# Altium schematic sheet Controller.SchDoc
size A3
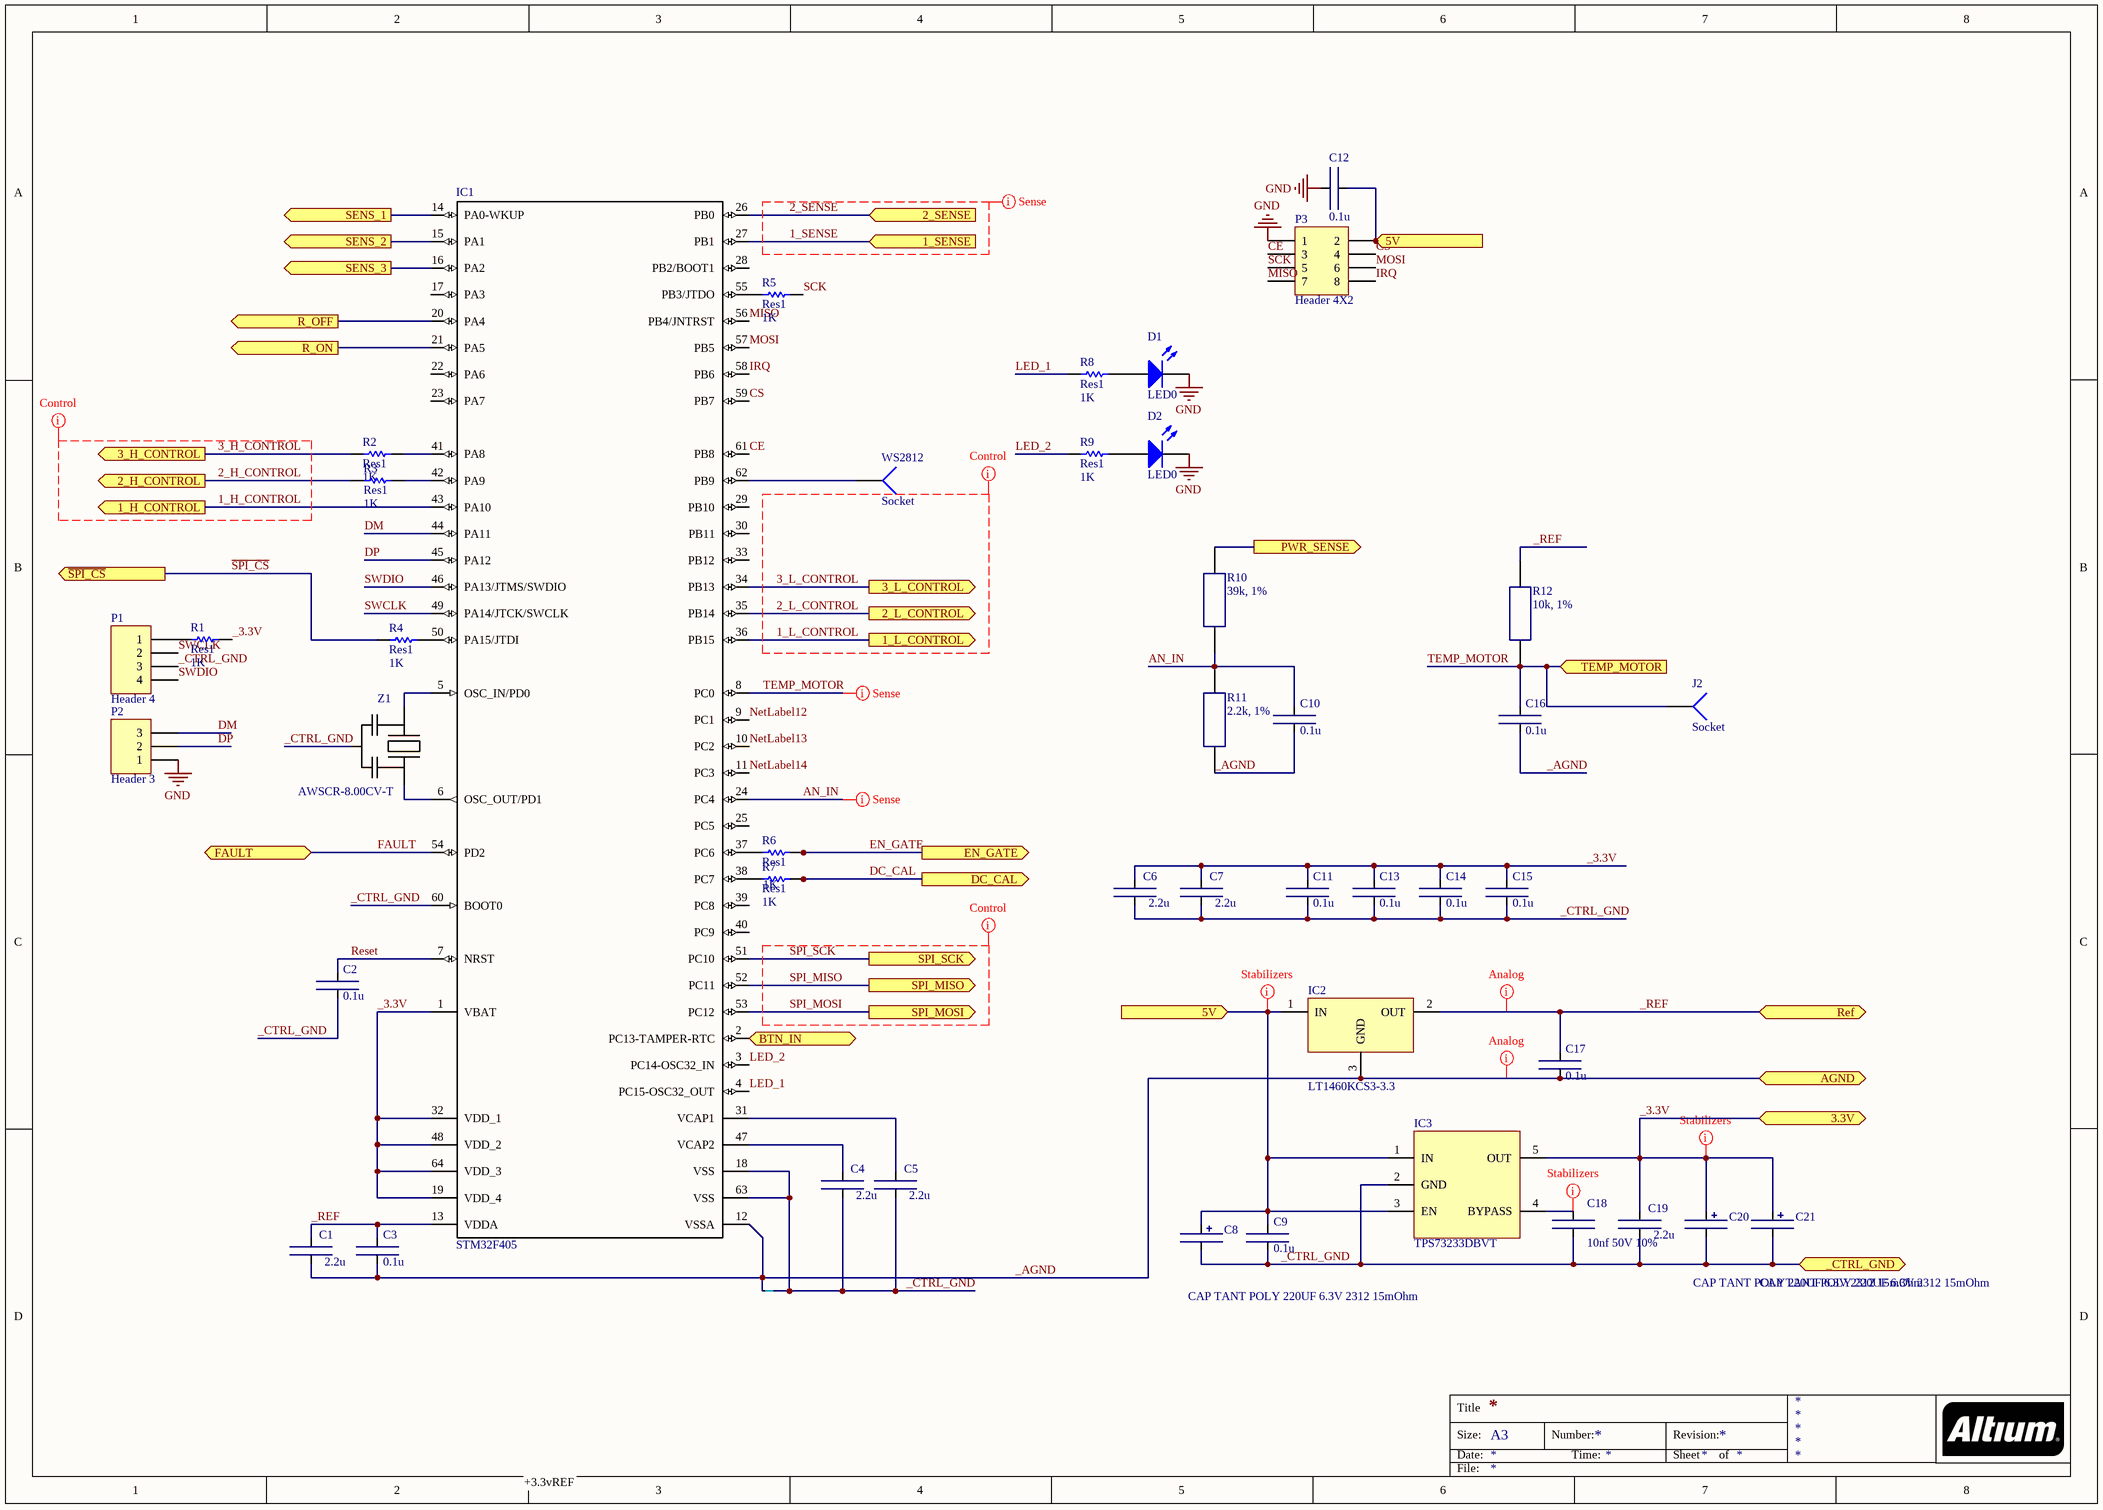
[diagram p0: Controller.SchDoc]

## Parts
C1  2.2u  [ERA-0603]
C2  0.1u  [CAPC1608X08N(0603)]
C3  0.1u  [ERA-0603]
C4  2.2u  [CAPC1608X08N(0603)]
C5  2.2u  [CAPC1608X08N(0603)]
C6  2.2u  [CAPC1608X08N(0603)]
C7  2.2u  [CAPC1608X08N(0603)]
C8  CAP TANT POLY 220UF 6.3V 2312 15mOhm  [CAP_POLY_330]
C9  0.1u  [ERA-0603]
C10  0.1u  [CAPC1608X08N(0603)]
C11  0.1u  [CAPC1608X08N(0603)]
C12  0.1u  [0805x]
C13  0.1u  [CAPC1608X08N(0603)]
C14  0.1u  [CAPC1608X08N(0603)]
C15  0.1u  [CAPC1608X08N(0603)]
C16  0.1u  [CAPC1608X08N(0603)]
C17  0.1u  [0603x]
C18  10nf 50V 10%  [0402small]
C19  2.2u  [CAPC1608X08N(0603)]
C20  CAP TANT POLY 220UF 6.3V 2312 15mOhm  [C]
C21  CAP TANT POLY 220UF 6.3V 2312 15mOhm  [CAP_POLY_330]
D1  LED0  [LED_3mm_SMD]
D2  LED0  [LED_3mm_SMD]
IC1  STM32F405  [LQFP64_L]
IC2  LT1460KCS3-3.3  [SOT23-3_L]
IC3  TPS73233DBVT  [SOT23-5_L]
J2  Socket  [PIN1]
NT1  NET_TIE  [NET_TIE_10mil]  (value not drawn)  (net tie, no BOM)
P1  Header 4  [MHDR1X4]
P2  Header 3  [HDR1X3]
P3  Header 4X2  [Nrf24l01]
R1  Res1  value 1K  [0603x]
R2  Res1  value 1K  [1206x]
R3  Res1  value 1K  [0603x]
R4  Res1  value 1K  [0603x]
R5  Res1  value 1K  [1206x]
R6  Res1  value 1K  [0805x]
R7  Res1  value 1K  [0603x]
R8  Res1  value 1K  [1206x]
R9  Res1  value 1K  [1206x]
R10  39k, 1%  [1206x]
R11  2.2k, 1%  [RESC1608X05N(0603)]
R12  10k, 1%  [RESC1608X05N(0603)]
WS2812  Socket  [PIN1]
Z1  AWSCR-8.00CV-T  [CRYSTAL_CERAMIC]

## Ports
1_H_CONTROL (out), 1_L_CONTROL (out), 1_SENSE (in), 2_H_CONTROL (out), 2_L_CONTROL (out), 2_SENSE (in), 3.3V, 3_H_CONTROL (out), 3_L_CONTROL (out), 5V (in), _CTRL_GND, AGND, BTN_IN, DC_CAL (out), EN_GATE (out), FAULT, PWR_SENSE (out), R_OFF (out), R_ON (out), Ref, SENS_1 (out), SENS_2 (out), SENS_3 (out), SPI_MISO (out), SPI_MOSI (out), SPI_SCK (out), TEMP_MOTOR (in), ~{SPI_CS} (out)

## Nets
GND: C12.1 D1.2(K) D2.2(K) P2.1 P3.1
1_H_CONTROL: IC1.43(PA10) ; port 1_H_CONTROL
1_L_CONTROL: IC1.36(PB15) ; port 1_L_CONTROL
1_SENSE: IC1.27(PB1) ; port 1_SENSE
2_H_CONTROL: R3.1 ; port 2_H_CONTROL
2_L_CONTROL: IC1.35(PB14) ; port 2_L_CONTROL
2_SENSE: IC1.26(PB0) ; port 2_SENSE
3_H_CONTROL: R2.1 ; port 3_H_CONTROL
3_L_CONTROL: IC1.34(PB13) ; port 3_L_CONTROL
5V: C8.1 C9.1 C12.2 IC2.1(IN) IC3.1(IN) IC3.3(EN) P3.2 ; port 5V
_3.3V: C6.1 C7.1 C11.1 C13.1 C14.1 C15.1 C19.1 C20.1 C21.1 IC1.1(VBAT) IC1.19(VDD_4) IC1.32(VDD_1) IC1.48(VDD_2) IC1.64(VDD_3) IC3.5(OUT) R1.2 ; port 3.3V
_AGND: C1.2 C3.2 C10.2 C16.2 C17.2 IC1.12(VSSA) IC2.3(GND) NT1.1 R11.2 ; port AGND
_CTRL_GND: C2.2 C4.2 C5.2 C6.2 C7.2 C8.2 C9.2 C11.2 C13.2 C14.2 C15.2 C18.2 C19.2 C20.2 C21.2 IC1.18(VSS) IC1.60(BOOT0) IC1.63(VSS) IC3.2(GND) NT1.2 P1.3 Z1.2(GND) ; port _CTRL_GND
_REF: C1.1 C3.1 C17.1 IC1.13(VDDA) IC2.2(OUT) R12.1 ; port Ref
AN_IN: C10.1 IC1.24(PC4) R10.2 R11.1
BTN_IN: IC1.2(PC13-TAMPER-RTC) ; port BTN_IN
CE: IC1.61(PB8) P3.3
CS: IC1.59(PB7) P3.4
DC_CAL: R7.2 ; port DC_CAL
DM: IC1.44(PA11) P2.3
DP: IC1.45(PA12) P2.2
EN_GATE: R6.2 ; port EN_GATE
FAULT: IC1.54(PD2) ; port FAULT
IRQ: IC1.58(PB6) P3.8
LED_1: IC1.4(PC15-OSC32_OUT) R8.1
LED_2: IC1.3(PC14-OSC32_IN) R9.1
MISO: IC1.56(PB4/JNTRST) P3.7
MOSI: IC1.57(PB5) P3.6
NetLabel12: IC1.9(PC1)
NetLabel13: IC1.10(PC2)
NetLabel14: IC1.11(PC3)
PWR_SENSE: R10.1 ; port PWR_SENSE
R_OFF: IC1.20(PA4) ; port R_OFF
R_ON: IC1.21(PA5) ; port R_ON
Reset: C2.1 IC1.7(NRST)
~{SPI_CS}: R4.1 ; port ~{SPI_CS}
SCK: P3.5 R5.2
SENS_1: IC1.14(PA0-WKUP) ; port SENS_1
SENS_2: IC1.15(PA1) ; port SENS_2
SENS_3: IC1.16(PA2) ; port SENS_3
SPI_MISO: IC1.52(PC11) ; port SPI_MISO
SPI_MOSI: IC1.53(PC12) ; port SPI_MOSI
SPI_SCK: IC1.51(PC10) ; port SPI_SCK
SWCLK: IC1.49(PA14/JTCK/SWCLK) P1.2
SWDIO: IC1.46(PA13/JTMS/SWDIO) P1.4
TEMP_MOTOR: C16.1 IC1.8(PC0) J2.1 R12.2 ; port TEMP_MOTOR
NetC4_1: C4.1 IC1.47(VCAP2)
NetC5_1: C5.1 IC1.31(VCAP1)
NetC18_1: C18.1 IC3.4(BYPASS)
NetD1_1: D1.1(A) R8.2
NetD2_1: D2.1(A) R9.2
NetIC1_5: IC1.5(OSC_IN/PD0) Z1.1(X1)
NetIC1_6: IC1.6(OSC_OUT/PD1) Z1.3(X2)
NetIC1_37: IC1.37(PC6) R6.1
NetIC1_38: IC1.38(PC7) R7.1
NetIC1_41: IC1.41(PA8) R2.2
NetIC1_42: IC1.42(PA9) R3.2
NetIC1_50: IC1.50(PA15/JTDI) R4.2
NetIC1_55: IC1.55(PB3/JTDO) R5.1
NetIC1_62: IC1.62(PB9) WS2812.1
NetP1_1: P1.1 R1.1

Not connected (* = marked no-connect by the designer): IC1 17(PA3) 22(PA6) 23(PA7) 25(PC5) 28(PB2/BOOT1) 29(PB10) 30(PB11) 33(PB12) 39(PC8) 40(PC9)

## Layout directives
net class Sense: 1_SENSE, 2_SENSE, AN_IN, TEMP_MOTOR
net class Stabilizers: 5V, _3.3V, _AGND, _REF, NetC18_1
net class Control: 1_H_CONTROL, 1_L_CONTROL, 2_H_CONTROL, 2_L_CONTROL, 3_H_CONTROL, 3_L_CONTROL, SPI_MISO, SPI_MOSI, SPI_SCK

## Notes on the sheet
- +3.3vREF
- Title
- Size:
- Date:
- A3
- Number:
- Time:
- Revision:
- Sheet
- of
- File:

## Library data of the parts
C1 C4-C7 C19 = Ceramic Chip Capacitor: Value: CAP CER 2.2UF 25V X5R 0603; Order Number: GRM188R61E225KA12D; Distributor: Murata Electronics; Package: CAPC1608X08N(0603)
C2 C3 C9-C17 = Ceramic Chip Capacitor: Value: CAP CER 0.1UF 50V X7R 0603; Order Number: 06035C104KAT2A; Distributor: AVX Corporation
  C2 C3 C9 C10 C16 C17: Package: 0603
  C11-C15: Package: CAPC1608X08N(0603)
C8 C20 C21 = Tantalum Chip Capacitor: Order Number: T520C227M006ATE015; Value: CAP TANT POLY 220UF 6.3V 2312 15mOhm; Package: C; Distributor: KEMET
C18 = Ceramic Chip Capacitor: Value: CAP CER 10000PF 50V X7R 0402; Order Number: CGA2B3X7R1H103K050BD; Distributor: TDK Corporation; Package: 0402
D1 D2 = LED0: Typical INFRARED GaAs LED; Published: 8-Jun-2000; LatestRevisionDate: 08-Jul-2005; LatestRevisionNote: Mech Layer 1 removed.; PackageReference: LED-0; Publisher: Altium Limited; PackageDescription: LED; 2 Leads
IC1 = STM32F405: STM32 ARM-based 32-bit MCU; Order Number: STM32F405RGT6; Value: STM32F405RGT6; Package: LQFP-64; Distributor: STMicroelectronics
IC2 = PreciseRef: Value: Voltage reference 3.3V 0.5% 50ppm/C; Order Number: LT1460KCS3-3.3#TRMPBF; Distrubutor: Linear Technology; Package: SOT23
IC3 = TPS7xx33: Value: LDO 3.3V 250mA; Order Number: TPS73233DBVT; Distributor: Texas Instruments; Package: SOT23-5
NT1 = Net tie
P1 = Header 4: Header, 4-Pin; LatestRevisionDate: 17-Jul-2002; LatestRevisionNote: Re-released for DXP Platform.; Publisher: Altium Limited
P2 = Header 3: Header, 3-Pin; LatestRevisionDate: 17-Jul-2002; LatestRevisionNote: Re-released for DXP Platform.; Publisher: Altium Limited
P3 = Header 4X2: Header, 4-Pin, Dual row; LatestRevisionDate: 17-Jul-2002; LatestRevisionNote: Re-released for DXP Platform.; Publisher: Altium Limited
R1-R9 = Res1: Resistor; Published: 8-Jun-2000; LatestRevisionDate: 17-Jul-2002; LatestRevisionNote: Re-released for DXP Platform.; PackageReference: AXIAL-0.3; Publisher: Altium Limited; PackageDescription: Axial Device, Thru-Hole; 2 Leads; 0.3 in Pin Spacing
R10 = SMD: Value: RES SMD 39K OHM 1% 1/10W 0603; Order Number: ERJ-3EKF3902V; Package: RESC1608X05N(0603); Distributor: Panasonic
R11 = SMD: Value: RES SMD 2.2K OHM 1% 1/10W 0603; Order Number: ERJ-3EKF2201V; Package: RESC1608X05N(0603); Distributor: Panasonic
R12 = SMD: Value: RES SMD 10K OHM 1% 1/10W 0603; Order Number: ERJ-3EKF1002V; Package: RESC1608X05N(0603); Distributor: Panasonic
Z1 = Crystal_smd_with_caps: Value: CER RES 8.0000MHZ 22PF SMD; Order Number: AWSCR-8.00CV-T; Distributor: Abracon LLC; Package: 3-SMD, Non-Standard
J2 WS2812 = Socket: LatestRevisionDate: 17-Jul-2002; LatestRevisionNote: Re-released for DXP Platform.; Publisher: Altium Limited